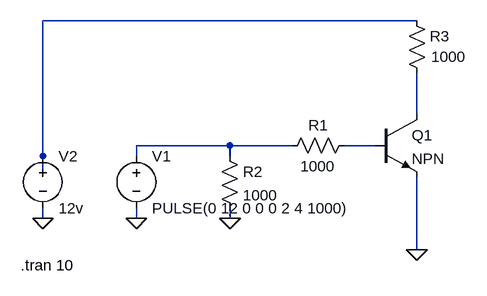
[diagram p0: schematic npn_high_side_switch.asc]
npn_high_side_switch.asc, the LTspice schematic file:
Version 4
SHEET 1 880 680
WIRE 272 -32 -304 -32
WIRE 272 112 272 48
WIRE -16 160 -160 160
WIRE 80 160 -16 160
WIRE 208 160 160 160
WIRE -304 176 -304 -32
WIRE -160 176 -160 160
WIRE -16 176 -16 160
WIRE -304 208 -304 176
WIRE -304 272 -304 256
WIRE -160 272 -160 256
WIRE -16 272 -16 256
WIRE 272 320 272 208
FLAG 272 320 0
FLAG -16 272 0
FLAG -160 272 0
FLAG -304 272 0
SYMBOL res 176 144 R90
WINDOW 0 0 56 VBottom 2
WINDOW 3 32 56 VTop 2
SYMATTR InstName R1
SYMATTR Value 1000
SYMBOL res -32 160 R0
SYMATTR InstName R2
SYMATTR Value 1000
SYMBOL res 256 -48 R0
WINDOW 3 38 71 Left 2
SYMATTR InstName R3
SYMATTR Value 1000
SYMBOL voltage -160 160 R0
WINDOW 123 0 0 Left 0
WINDOW 39 0 0 Left 0
SYMATTR InstName V1
SYMATTR Value PULSE(0 12 0 0 0 2 4 1000)
SYMBOL voltage -304 160 R0
WINDOW 123 0 0 Left 0
WINDOW 39 0 0 Left 0
SYMATTR InstName V2
SYMATTR Value 12v
SYMBOL npn 208 112 R0
SYMATTR InstName Q1
TEXT -338 344 Left 2 !.tran 10

The netlist it stands for:
* npn_high_side_switch.asc
R1 N004 N003 1000
R2 N003 0 1000
R3 N001 N002 1000
V1 N003 0 PULSE(0 12 0 0 0 2 4 1000)
V2 N001 0 12v
Q1 N002 N004 0 0 NPN
.model NPN NPN
.model PNP PNP
.lib standard.bjt
.tran 10
.backanno
.end